# Altium schematic sheet LaserController.SchDoc
size A; PageSetup: Record=PageOptions|CenterHorizontal=True|CenterVertical=True|PrintScale=0.95|XCorrection=1.00|YCorrection=1.00|PrintKind=1|BorderSize=5000000|LeftOffset=0|BottomOffset=0|Orientation=2|PaperLength=1000|PaperWidth=1000|Scale=100|PaperSource=7|PrintQuality=-4|MediaType=1|DitherType=10|PaperKind=Executive|PrintScaleMode=1
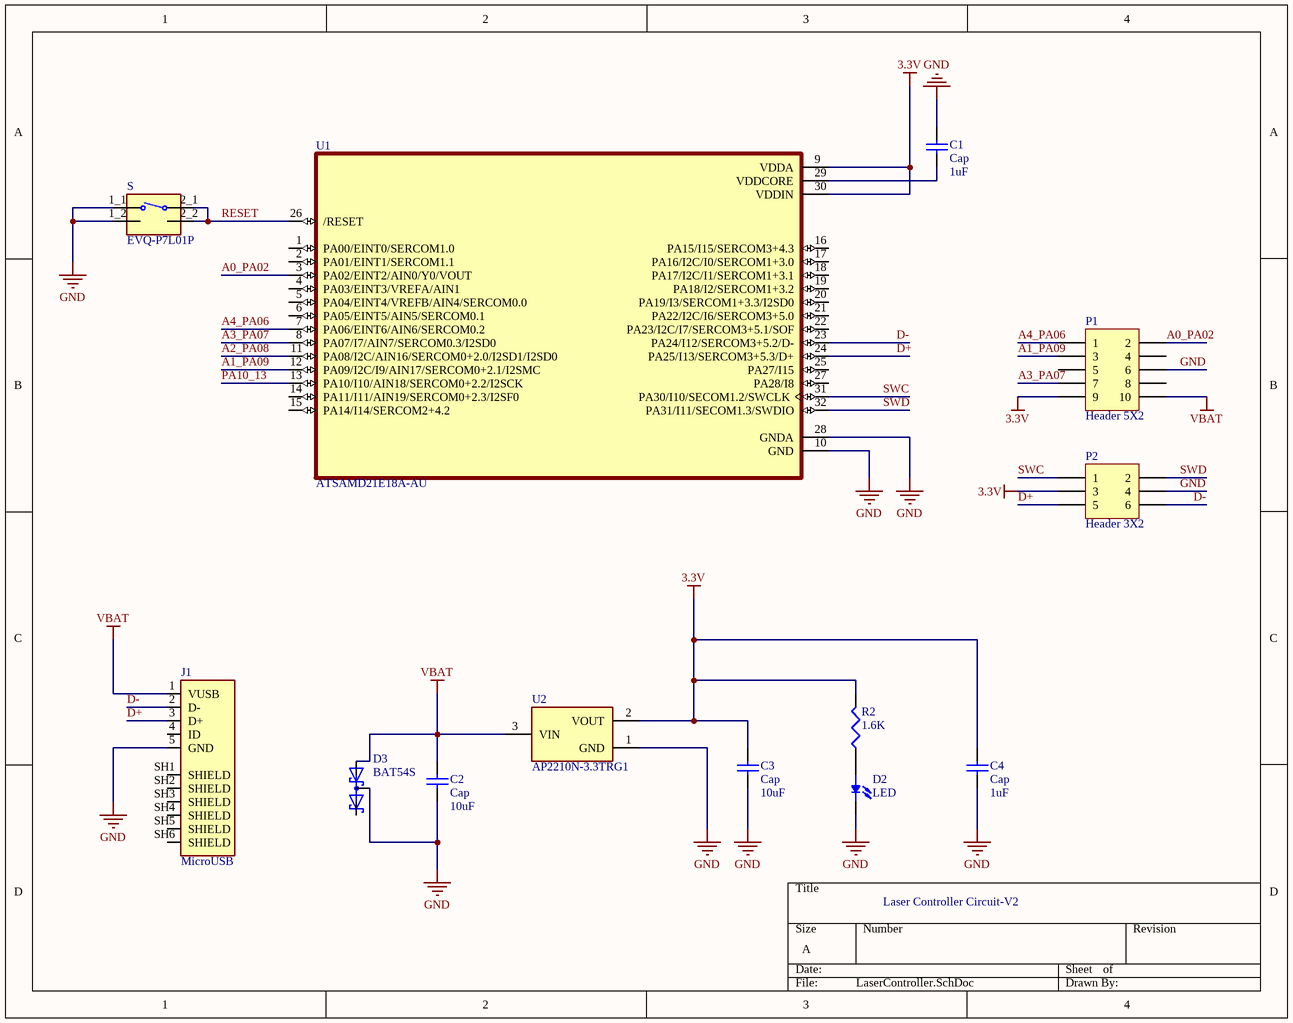
[diagram p0: LaserController.SchDoc]

## Parts
C1  Cap  value 1uF  [6-0805_M]
C2  Cap  value 10uF  [6-0805_M]
C3  Cap  value 10uF  [6-0805_M]
C4  Cap  value 1uF  [6-0805_M]
D2  LED  [DIO_SMLMN2WB1CW1C]
D3  BAT54S  [SOT23]
J1  MicroUSB  [AMPHENOL_10118192-0001LF]
P1  Header 5X2  [HDR2X5]
P2  Header 3X2  [HDR2X3]
R2  1.6K  [6-0805_M]
S  EVQ-P7L01P  [SW_EVQ-P7L01P]
U1  ATSAMD21E18A-AU  [QFP80P900X900X120-32N]
U2  AP2210N-3.3TRG1  [SOT95P280X145-3N]

## Nets
3.3V: C3.2 C4.2 P1.9 P2.3 R2.2 U1.9(VDDA) U1.30(VDDIN) U2.2(VOUT)
GND: C1.2 C2.1 C3.1 C4.1 D2.C D3.3(K1A2) J1.5(GND) P1.6 P2.4 S.1_1 S.1_2 U1.10(GND) U1.28(GNDA) U2.1(GND)
VBAT: C2.2 D3.1(A1) J1.1(VUSB) P1.10 U2.3(VIN)
A0_PA02: P1.2 U1.3(PA02/EINT2/AIN0/Y0/VOUT)
A1_PA09: P1.3 U1.12(PA09/I2C/I9/AIN17/SERCOM0+2.1/I2SMC)
A2_PA08: U1.11(PA08/I2C/AIN16/SERCOM0+2.0/I2SD1/I2SD0)
A3_PA07: P1.7 U1.8(PA07/I7/AIN7/SERCOM0.3/I2SD0)
A4_PA06: P1.1 U1.7(PA06/EINT6/AIN6/SERCOM0.2)
D+: J1.3(D+) P2.5 U1.24(PA25/I13/SERCOM3+5.3/D+)
D-: J1.2(D-) P2.6 U1.23(PA24/I12/SERCOM3+5.2/D-)
PA10_13: U1.13(PA10/I10/AIN18/SERCOM0+2.2/I2SCK)
RESET: S.2_1 S.2_2 U1.26(/RESET)
SWC: P2.1 U1.31(PA30/I10/SECOM1.2/SWCLK)
SWD: P2.2 U1.32(PA31/I11/SECOM1.3/SWDIO)
NetC1_1: C1.1 U1.29(VDDCORE)
NetD2_A: D2.A R2.1

Not connected (* = marked no-connect by the designer): D3 2(K2); J1 4(ID) SH1(SHIELD) SH2(SHIELD) SH3(SHIELD) SH4(SHIELD) SH5(SHIELD) SH6(SHIELD); P1 4 5 8; U1 1(PA00/EINT0/SERCOM1.0) 2(PA01/EINT1/SERCOM1.1) 4(PA03/EINT3/VREFA/AIN1) 5(PA04/EINT4/VREFB/AIN4/SERCOM0.0) 6(PA05/EINT5/AIN5/SERCOM0.1) 14(PA11/I11/AIN19/SERCOM0+2.3/I2SF0) 15(PA14/I14/SERCOM2+4.2) 16(PA15/I15/SERCOM3+4.3) 17(PA16/I2C/I0/SERCOM1+3.0) 18(PA17/I2C/I1/SERCOM1+3.1) 19(PA18/I2/SERCOM1+3.2) 20(PA19/I3/SERCOM1+3.3/I2SD0) 21(PA22/I2C/I6/SERCOM3+5.0) 22(PA23/I2C/I7/SERCOM3+5.1/SOF) 25(PA27/I15) 27(PA28/I8)

## Notes on the sheet
- Laser Controller Circuit-V2

## Library data of the parts
C1-C4 = Cap: Capacitor; Published: 8-Jun-2000; LatestRevisionDate: 17-Jul-2002; LatestRevisionNote: Re-released for DXP Platform.; PackageReference: RAD-0.3; Publisher: Altium Limited; PackageDescription: Radial Cap, Thru-Hole; 2 Leads; 0.3 in Pin Spacing
D2 = SMLMN2WB1CW1C: White LED Indication - Discrete 2.9V 0805 _2012 Metric_; MF: Rohm Semiconductor; SnapEDA_Link: https://www.snapeda.com/parts/SMLMN2WB1CW1C/Rohm/view-part/3217279/?ref=snap; Availability: Unavailable; MP: SMLMN2WB1CW1C; Value: *; Price: None; Package: 0805 Rohm Semiconductor
D3 = BAT54S: Diode Array 1 Pair Series Connection Schottky 30V 200mA Surface Mount TO-236-3, SC-59, SOT-23-3; MF: ON Semiconductor; Price: None; Value: *; Package: SOT-23-3 ON Semiconductor; Availability: Unavailable; SnapEDA_Link: https://www.snapeda.com/parts/BAT54S/ON%20Semiconductor/view-part/1737355/?ref=snap; MP: BAT54S
J1 = 10118192-0001LF: USB - micro B USB 2.0 Receptacle Connector 5 Position Surface Mount, Right Angle; MF: Amphenol ICC; Availability: Unavailable; Price: None; Package: None; MP: 10118192-0001LF; Value: *; SnapEDA_Link: https://www.snapeda.com/parts/10118192-0001LF/Amphenol%20FCI/view-part/2897676/?ref=snap
P1 = Header 5X2: Header, 5-Pin, Dual row; LatestRevisionDate: 17-Jul-2002; LatestRevisionNote: Re-released for DXP Platform.; Publisher: Altium Limited
P2 = Header 3X2: Header, 3-Pin, Dual row; LatestRevisionDate: 17-Jul-2002; LatestRevisionNote: Re-released for DXP Platform.; Publisher: Altium Limited
R2 = Res3: Resistor; Published: 8-Jun-2000; LatestRevisionDate: 29-May-2009; LatestRevisionNote: IPC-7351 Footprint Added.; PackageReference: J1-0603; Publisher: Altium Limited; PackageDescription: Chip Resistor
S = EVQ-P7L01P: Tactile Switch SPST-NO Side Actuated Surface Mount, Right Angle; MF: Panasonic Electronic Components; MP: EVQ-P7L01P; Package: None; Value: *; Digi-Key_Purchase_URL: https://www.digikey.co.nz/product-detail/en/panasonic-electronic-components/EVQ-P7L01P/P16769CT-ND/4429462?utm_source=snapeda&utm_medium=aggregator&utm_campaign=symbol; Digi-Key_Part_Number: P16769CT-ND; SnapEDA_Link: https://www.snapeda.com/parts/EVQ-P7L01P/Panasonic%20Electronic%20Components/view-part/3622449/?ref=snap
U1 = ATSAMD21E18A-AU: ARM庐 Cortex庐-M0+ SAM D21E Microcontroller IC 32-Bit 48MHz 256KB (256K x 8) FLASH 32-TQFP (7x7); MF: Microchip; Availability: Unavailable; MP: ATSAMD21E18A-AU; DigiKey-Purchase-URL: https://snapeda.com/shop?store=DigiKey&id=1758526; SnapEDA_Link: https://www.snapeda.com/parts/ATSAMD21E18A-AU/Microchip/view-part/1758526/?ref=snap; Price: None; Value: *; Mouser-Purchase-URL: https://snapeda.com/shop?store=Mouser&id=1758526; Package: TQFP-32 Microchip
U2 = AP2210N-3.3TRG1: Linear Voltage Regulator IC 1 Output 300mA SOT-23-3; MF: Diodes Inc.; Value: *; SnapEDA_Link: https://www.snapeda.com/parts/AP2210N-3.3TRG1/Diodes%20Inc./view-part/492437/?ref=snap; Availability: Unavailable; Price: None; Package: SOT-23 Diodes Inc.; MP: AP2210N-3.3TRG1